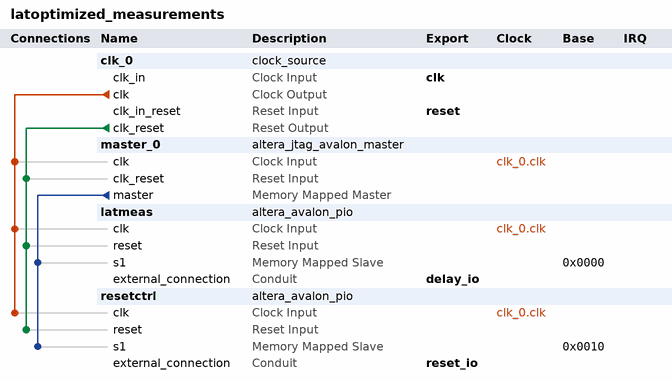
[diagram p0: system contents]
# Platform Designer (Qsys) system latoptimized_measurements, Arria 10 10AX115S3F45E2SG
# Parameters at their usual value, and those the tool derives, are not listed.
package require -exact qsys 15.1
create_system latoptimized_measurements
set_project_property DEVICE_FAMILY {Arria 10}
set_project_property DEVICE 10AX115S3F45E2SG

add_instance clk_0 clock_source 15.1
set_instance_parameter_value clk_0 clockFrequency 50000000

add_instance master_0 altera_jtag_avalon_master 15.1

add_instance latmeas altera_avalon_pio 15.1
set_instance_parameter_value latmeas direction Input
set_instance_parameter_value latmeas width 32

add_instance resetctrl altera_avalon_pio 15.1
set_instance_parameter_value resetctrl direction Output
set_instance_parameter_value resetctrl width 1

# connections
add_connection clk_0.clk latmeas.clk clock
add_connection clk_0.clk master_0.clk clock
add_connection clk_0.clk resetctrl.clk clock
add_connection clk_0.clk_reset latmeas.reset reset
add_connection clk_0.clk_reset master_0.clk_reset reset
add_connection clk_0.clk_reset resetctrl.reset reset
add_connection master_0.master latmeas.s1 avalon
set_connection_parameter_value master_0.master/latmeas.s1 baseAddress 0x0000
add_connection master_0.master resetctrl.s1 avalon
set_connection_parameter_value master_0.master/resetctrl.s1 baseAddress 0x0010

# exported interfaces
add_interface clk clock sink
set_interface_property clk EXPORT_OF clk_0.clk_in
add_interface delay_io conduit end
set_interface_property delay_io EXPORT_OF latmeas.external_connection
add_interface reset reset sink
set_interface_property reset EXPORT_OF clk_0.clk_in_reset
add_interface reset_io conduit end
set_interface_property reset_io EXPORT_OF resetctrl.external_connection

set_interconnect_requirement {$system} qsys_mm.clockCrossingAdapter HANDSHAKE
set_interconnect_requirement {$system} qsys_mm.enableEccProtection FALSE
set_interconnect_requirement {$system} qsys_mm.insertDefaultSlave FALSE
set_interconnect_requirement {$system} qsys_mm.maxAdditionalLatency 1

save_system latoptimized_measurements.qsys
